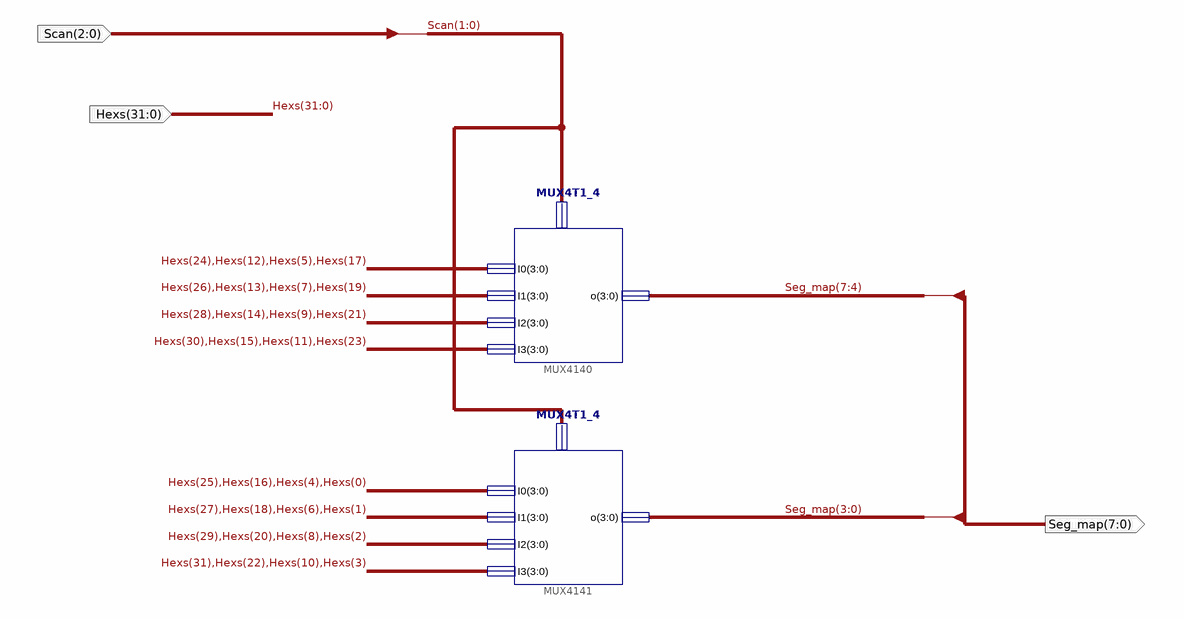
[diagram p0: schematic sheet 1]
// Xilinx ISE schematic Seg_map.sch (kintex7) as structural Verilog: 2 symbols, 3 ports
module Seg_map (
  input  [31:0] Hexs,
  input  [2:0] Scan,
  output [7:0] Seg_map
);

  MUX4T1_4 MUX4140 (
    .I0({Hexs[24], Hexs[12], Hexs[5], Hexs[17]}), .I1({Hexs[26], Hexs[13], Hexs[7], Hexs[19]}),
    .I2({Hexs[28], Hexs[14], Hexs[9], Hexs[21]}), .I3({Hexs[30], Hexs[15], Hexs[11], Hexs[23]}),
    .s(Scan[1:0]), .o(Seg_map[7:4]));
  MUX4T1_4 MUX4141 (
    .I0({Hexs[25], Hexs[16], Hexs[4], Hexs[0]}), .I1({Hexs[27], Hexs[18], Hexs[6], Hexs[1]}),
    .I2({Hexs[29], Hexs[20], Hexs[8], Hexs[2]}), .I3({Hexs[31], Hexs[22], Hexs[10], Hexs[3]}), .s(Scan[1:0]),
    .o(Seg_map[3:0]));
endmodule
